# EAGLE design LaserGatesController (EAGLE 9.6.2)
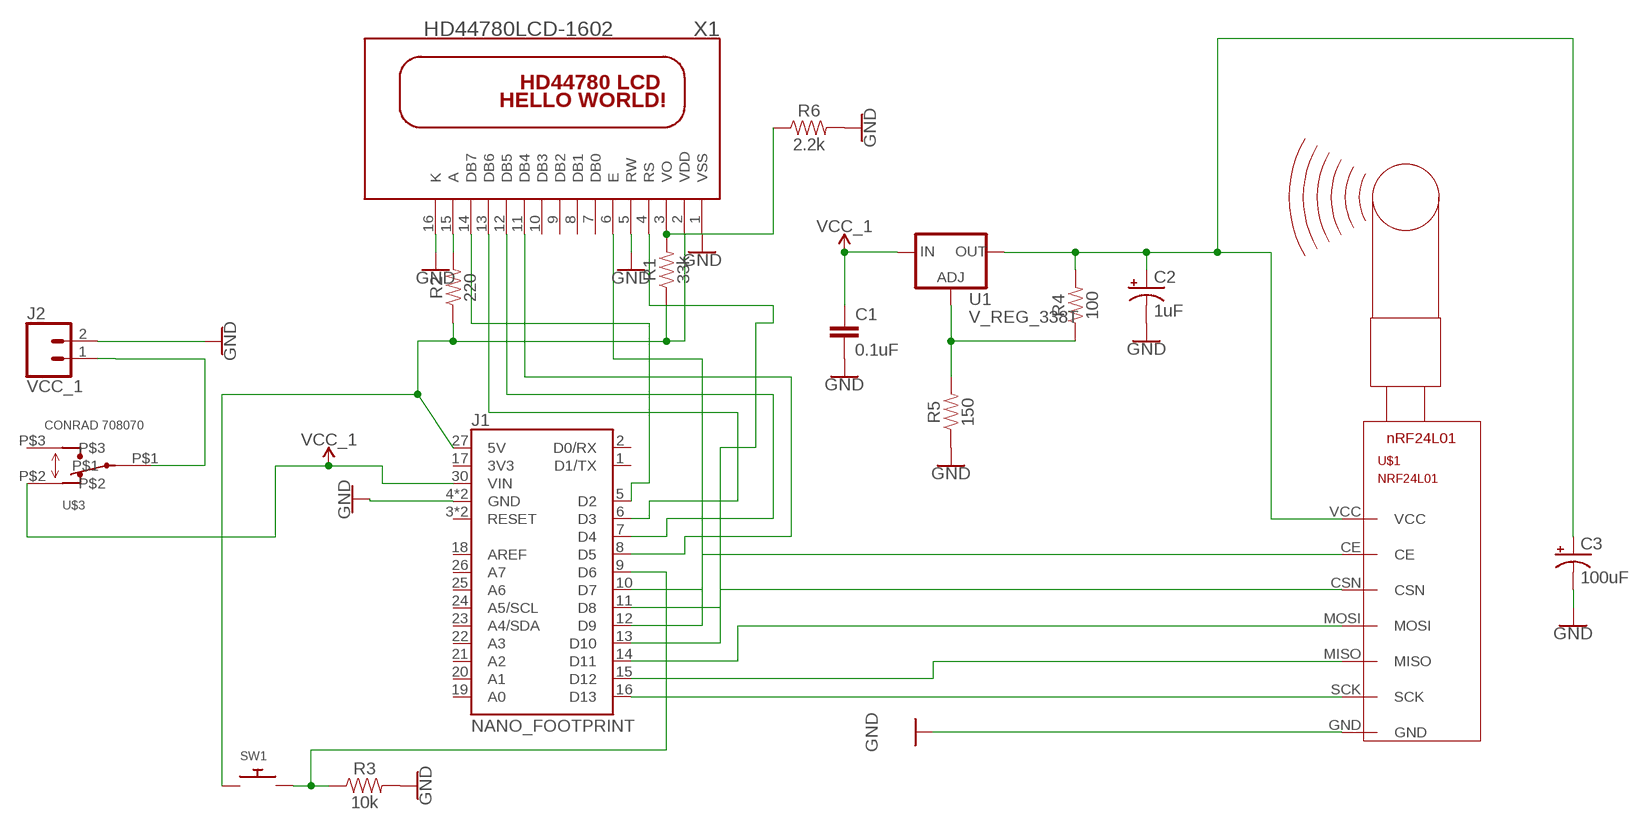
[diagram p0: schematic, sheet 1]

## Parts
C1  0.1uF  0.1UF-KIT-EZ-50V-20%  [CAP-PTH-SMALL-KIT]
C2  1uF  10UF-POLAR-RADIAL-2.5MM-25V-20%  [CPOL-RADIAL-2.5MM-5MM]
C3  100uF  1000UF-RADIAL-5MM-25V-20%  [CPOL-RADIAL-5MM-10MM]
J1  NANO_FOOTPRINT  [NANO]
J2  VCC_1  CONN_02  [1X02]
R1  33k  1KOHM-HORIZ-1/4W-1%  [AXIAL-0.3]
R2  220  1KOHM-HORIZ-1/4W-1%  [AXIAL-0.3]
R3  10k  10KOHM-HORIZ-1/4W-1%  [AXIAL-0.3]
R4  100  1KOHM-HORIZ-1/4W-1%  [AXIAL-0.3]
R5  150  1KOHM-HORIZ-1/4W-1%  [AXIAL-0.3]
R6  2.2k  1MOHM-HORIZ-1/6W-5%  [AXIAL-0.3]
SW1  SWITCH_PUSHBUTTONEVQ-PE  [TACT_PANA-EVQ]
U1  V_REG_338T  V_REG_317SINK  [TO220-ADJ]
U$1  NRF24L01  [NRF24L01]
U$3  SLIDE-SWITCH-CONRAD708070  [SLIDE-SWITCH-CONRAD708070]
X1  HD44780LCD-1602  [LCD1602]

## Nets
GND: C1.2 C2.2(-) C3.- J1.4(GND) J1.29(GND) J2.2 R3.P$2 R5.P$1 R6.P$2 U$1.GND X1.1(VSS) X1.5(RW) X1.16(K)
N$1: J1.11(D8) U$1.CSN
N$2: J1.10(D7) U$1.CE
N$3: J1.16(D13) U$1.SCK
N$4: J1.14(D11) U$1.MOSI
N$5: J1.15(D12) U$1.MISO
N$6: J1.5(D2) X1.14(DB7)
N$7: J1.13(D10) X1.4(RS)
N$8: J1.12(D9) X1.6(E)
N$9: J1.8(D5) X1.11(DB4)
N$10: J2.1 U$3.P$1
N$11: J1.7(D4) X1.12(DB5)
N$12: J1.6(D3) X1.13(DB6)
N$13: R4.P$1 R5.P$2 U1.ADJ
N$14: C2.1(+) C3.+ R4.P$2 U1.OUT U$1.VCC
N$15: R2.P$2 X1.15(A)
N$16: J1.9(D6) R3.P$1 SW1.P$2
N$17: R1.P$2 R6.P$1 X1.3(VO)
VCC_1: C1.1 J1.30(VIN) U1.IN U$3.P$2
VDD: J1.27(5V) R1.P$1 R2.P$1 SW1.P$1 X1.2(VDD)
Unconnected: J1.1(D1/TX) J1.2(D0/RX) J1.3(RESET) J1.17(3V3) J1.18(AREF) J1.19(A0) J1.20(A1) J1.21(A2) J1.22(A3) J1.23(A4/SDA) J1.24(A5/SCL) J1.25(A6) J1.26(A7) J1.28(RESET) U$3.P$3 X1.7(DB0) X1.8(DB1) X1.9(DB2) X1.10(DB3)

## Library data of the parts
C1 = SparkFun-Capacitors:0.1UF: 0.1µF ceramic capacitors A capacitor is a passive two-terminal electrical component used to store electrical energy temporarily in an electric field.; PROD_ID: CAP-08370
C2 = SparkFun-Capacitors:10UF-POLAR: 10.0µF polarized capacitors A capacitor is a passive two-terminal electrical component used to store electrical energy temporarily in an electric field.; PROD_ID: CAP-08440; VALUE: 10uF
C3 = SparkFun-Capacitors:1000UF: 1,000µF/1mF ceramic capacitors A capacitor is a passive two-terminal electrical component used to store electrical energy temporarily in an electric field. CAP-08070; PROD_ID: CAP-09538; VALUE: 1mF
J1 = SparkFun-Boards:NANO_FOOTPRINT: Generic Nano Footprint
J2 = SparkFun-Connectors:CONN_02: Multi connection point. Often used as Generic Header-pin footprint for 0.1 inch spaced/style header connections On any of the 0.1 inch spaced packages, you can populate with these: Break Away Headers - Straight <https://www.sparkfun.com/products/116> (PRT-00116) Break Away Male Headers - Right Angle <https://www.sparkfun.com/products/553> (PRT-00553) Female Headers <https://www.sparkfun.com/products/115> (PRT-00115) Break Away Headers - Machine Pin <https://www.sparkfun.com/products/117> (PRT-00117) Break Away Female Headers - Swiss Machine Pin <https://www.sparkfun.com/products/743> (PRT-00743) For SCREWTERMINALS and SPRING TERMINALS visit here: Screw Terimnals on SparkFun.com <https://www.sparkfun.com/search/results?term=Screw+Terminals> (5mm/3.5mm/2.54mm spacing) This device is also useful as a general connection point to wire up your design to another part of your project. Our various solder wires solder well into these plated through hole pads. Hook-Up Wire - Assortment (Stranded, 22 AWG) <https://www.sparkfun.com/products/11375> (PRT-11375) Hook-Up Wire - Assortment (Solid Core, 22 AWG) <https://www.sparkfun.com/products/11367> (PRT-11367) View the entire wire category on our website here <https://www.sparkfun.com/categories/141> Special notes: Molex polarized connector foot print use with: PRT-08233 with associated crimp pins and housings. 2.54_SCREWTERM for use with PRT-10571. 3.5mm Screw Terminal footprints for PRT-08084 5mm Screw Terminal footprints for use with PRT-08432
R1 R2 R4 R5 = SparkFun-Resistors:1KOHM: 1kΩ resistor A resistor is a passive two-terminal electrical component that implements electrical resistance as a circuit element. Resistors act to reduce current flow, and, at the same time, act to lower voltage levels within circuits. - Wikipedia; PROD_ID: RES-12182; VALUE: 1k
R3 = SparkFun-Resistors:10KOHM: 10kΩ resistor A resistor is a passive two-terminal electrical component that implements electrical resistance as a circuit element. Resistors act to reduce current flow, and, at the same time, act to lower voltage levels within circuits. - Wikipedia; PROD_ID: RES-12183
R6 = SparkFun-Resistors:1MOHM: 1MΩ resistor A resistor is a passive two-terminal electrical component that implements electrical resistance as a circuit element. Resistors act to reduce current flow, and, at the same time, act to lower voltage levels within circuits. - Wikipedia; PROD_ID: RES-09559; VALUE: 1M
SW1 = adafruit:SWITCH_PUSHBUTTON: Buttons SOFTTOUCHSMD_SJ - Soft touch temporary push button (Super Junk Akihabara) Compatible with SKPMANE010 [Mouser: 688-SKPMAN] C&K_KSS = Digikey: KSS221GLFS
U1 = SparkFun-IC-Power:V_REG_317: Voltage Regulator Standard LM317 adjustable voltage regulator. AOI (Adjust Output Input). Google 'LM317 Calculator' for easy to use app to get the two resistor values needed. 240/720 for 5V output. 240/390 for 3.3V output. Spark Fun Electronics SKU : COM-00527
U$1 = Clean-Kong:NRF24L01: nrF54L01 2.4GHz with 100 Channels Emitter/Reveiver SPI Controlled Roboshop / Minint
U$3 = Clean-Kong:SLIDE-SWITCH-CONRAD708070
X1 = adafruit:HD44780LCD: HD44780 LCD Standard character type LCDs, available in sizes from 8x1 to 40x4!

## Board
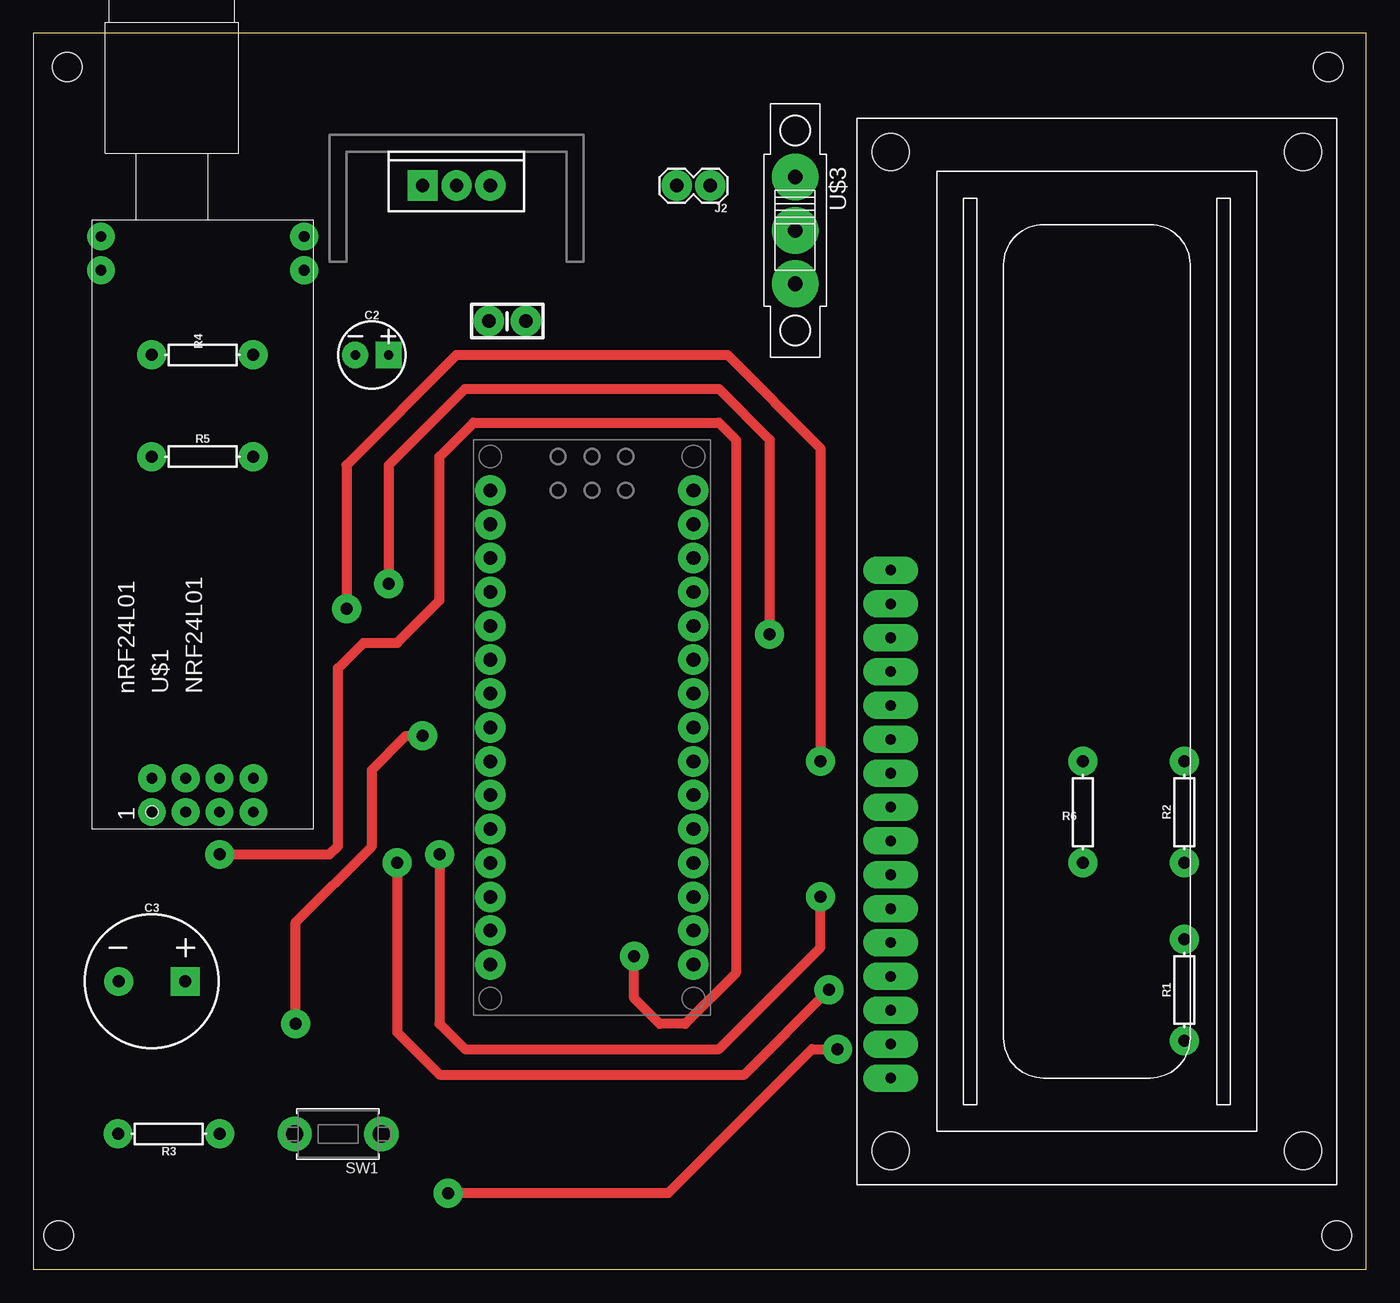
[diagram p1: board, top side]
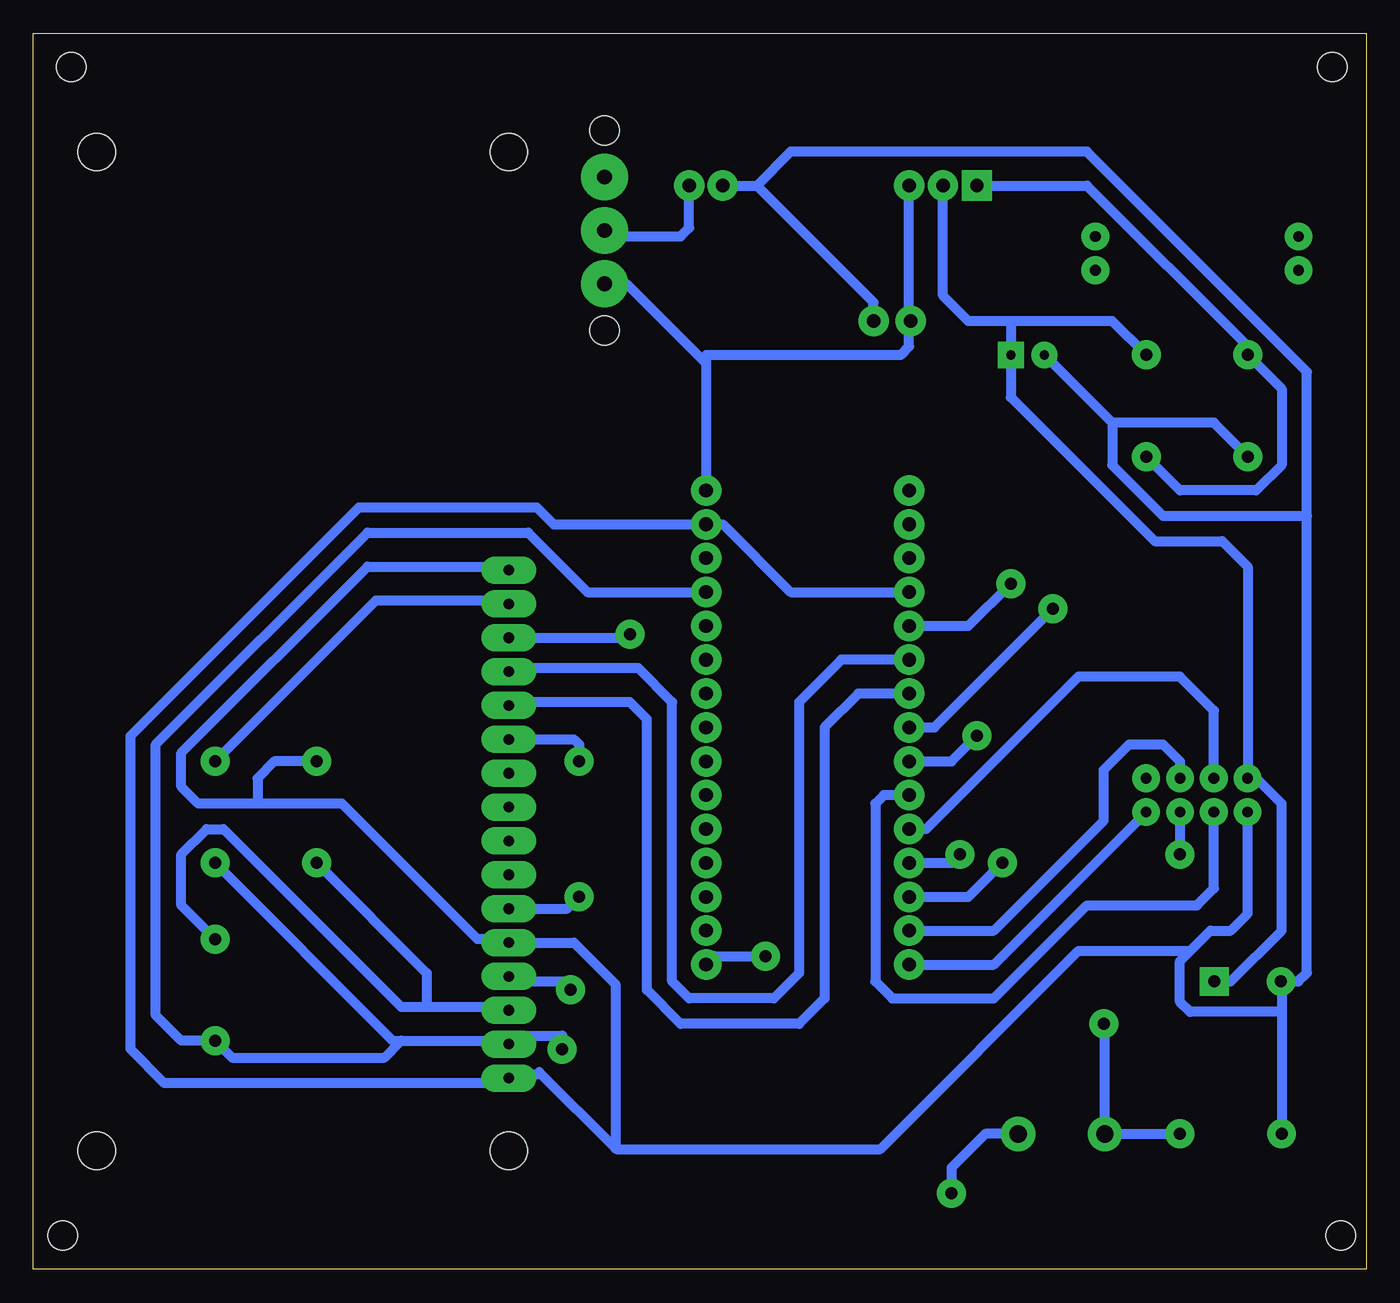
[diagram p2: board, bottom side, seen from below]

Size 100 x 92.7 mm. Coordinates in mm from the lower left corner, seen from the top.
Outline: 0,0 100,0 100,92.7 0,92.7 0,0
Copper layers (1*16): Top 0.035mm / dielectric 1.5mm / Bottom 0.035mm
Design rules "mydesignrules": minimum track width 30mil, minimum drill 0.9mm, track to track 30mil, track to pad 30mil, pad to pad 30mil, via to via 30mil, smd to smd 20mil, copper to edge 80mil, drill to drill 20mil, minimum pad ring 25mil, minimum via ring 25mil, stop-mask expansion 4mil, vias tented up to drill 0mil, thermal gap 10mil
Holes 2.2 mm at 97.16,90.17 97.79,2.54 1.91,2.54 2.54,90.17

### Footprints (pad centres in the part's own frame; a part is rotated, then mirrored left to right if it is on the bottom)
CAP-PTH-SMALL-KIT = drill 1.016 pad 2.032: 1 -1.397,0; 2 1.397,0
CPOL-RADIAL-2.5MM-5MM = drill 0.7 pad 1.651 square: 1 1.25,0 | drill 0.7 pad 1.651: 2 -1.25,0
CPOL-RADIAL-5MM-10MM = drill 0.9 pad 1.93 square: + 2.5,0 | drill 0.9 pad 1.93: - -2.5,0
NANO = drill 1.016: 1 -7.62,17.78; 2 -7.62,15.24; 3 -7.62,12.7; 4 -7.62,10.16; 5 -7.62,7.62; 6 -7.62,5.08; 7 -7.62,2.54; 8 -7.62,0; 9 -7.62,-2.54; 10 -7.62,-5.08; 11 -7.62,-7.62; 12 -7.62,-10.16; 13 -7.62,-12.7; 14 -7.62,-15.24; 15 -7.62,-17.78; 16 7.62,-17.78; 17 7.62,-15.24; 18 7.62,-12.7; 19 7.62,-10.16; 20 7.62,-7.62; 21 7.62,-5.08; 22 7.62,-2.54; 23 7.62,0; 24 7.62,2.54; 25 7.62,5.08; 26 7.62,7.62; 27 7.62,10.16; 28 7.62,12.7; 29 7.62,15.24; 30 7.62,17.78
1X02 = drill 1.016 pad 1.88: 1 0,0; 2 2.54,0
AXIAL-0.3 = drill 0.9 pad 1.88: P$1 -3.81,0; P$2 3.81,0
TACT_PANA-EVQ = drill 1.3 pad 2.54: P$1 -3.25,0; P$2 3.25,0
TO220-ADJ = drill 1 pad 1.88 square: ADJ -2.54,0 | drill 1 pad 1.88: IN 2.54,0; OUT 0,0
NRF24L01 = drill 0.8 pad 1.676: CE 0,-2.54; CSN 2.54,-2.54; GND 0,0; MISO 0,-7.62; MOSI 2.54,-5.08; P$1 40.64,-11.43; P$2 43.18,-11.43; P$3 43.18,3.81; P$4 40.64,3.81; P$8 2.54,-7.62; SCK 0,-5.08; VCC 2.54,0
SLIDE-SWITCH-CONRAD708070 = drill 1.1 pad 3.5: P$1 4,0; P$2 8,0; P$3 0,0 | hole 2.2: -3.5,0; 11.5,0
LCD1602 = drill 0.8 long: 1 8,33.46; 2 10.54,33.46; 3 13.08,33.46; 4 15.62,33.46; 5 18.16,33.46; 6 20.7,33.46; 7 23.24,33.46; 8 25.78,33.46; 9 28.32,33.46; 10 30.86,33.46; 11 33.4,33.46; 12 35.94,33.46; 13 38.48,33.46; 14 41.02,33.46; 15 43.56,33.46; 16 46.1,33.46 | hole 2.8: 2.54,2.54; 2.54,33.46; 77.46,33.46; 77.46,2.54

### Placement (x,y rotation side)
C1  35.56,71.12 0 top
C2  25.4,68.58 0 top
C3  8.89,21.59 0 top
J1  41.91,40.64 0 top
J2  50.8,81.28 180 top
R1  86.36,20.95 90 top
R2  86.36,34.29 90 top
R3  10.16,10.16 180 top
R4  12.7,68.58 0 top
R5  12.7,60.96 0 top
R6  78.74,34.29 90 top
SW1  22.86,10.16 180 top
U1  31.75,81.28 0 top
U$1  8.89,34.29 90 top
U$3  57.15,81.92 270 top
X1  97.79,6.35 90 top

### Tracks (layer width: path | path; a pad name or v marks a point on that pad's centre or on a via)
GND
  Bottom 0.762: 45.72,81.28 36.96,72.52 C1.2 | J2.2 45.72,81.28 | 19.05,63.5 24.13,68.58 C2.2 | 19.05,63.5 11.43,63.5 R5.P$1 | 45.72,81.28 43.18,83.82 20.95,83.82 4.45,67.31 4.45,56.52 | 4.45,56.52 15.24,56.52 19.05,60.33 19.05,63.5 | J1.4 43.18,50.8 48.26,55.88 J1.29 60.96,55.88 62.23,57.15 75.56,57.15 92.71,40.01 92.71,16.51 90.17,13.97 64.77,13.97 X1.1 64.14,14.61 62.23,14.61 62.04,14.8 56.33,9.08 | U$1.GND 8.89,26.67 10.16,25.4 11.68,25.4 13.21,23.88 | 6.99,21.59 C3.- 6.35,21.59 | 83.19,34.92 76.83,34.92 66.67,24.77 64.77,24.77 X1.5 59.44,24.51 56.33,21.4 56.33,9.08 | 83.19,34.92 87.63,34.92 88.9,36.2 88.9,38.73 74.93,52.7 64.77,52.7 X1.16 | 6.35,21.59 5.08,21.59 4.45,22.23 4.45,56.52 | 6.35,21.59 6.35,19.3 | 6.35,19.3 R3.P$2 | 13.21,23.88 13.97,23.11 13.97,20.07 13.21,19.3 6.35,19.3 | 13.21,23.88 21.59,23.88 36.45,9.02 56.26,9.02 56.33,9.08 | R6.P$2 81.92,38.1 83.19,36.83 83.19,34.92
N$1
  Bottom 0.762: U$1.CSN 11.43,41.91 13.97,44.45 21.59,44.45 33.02,33.02 J1.11
N$2
  Bottom 0.762: U$1.CE 11.43,28.57 12.7,27.3 20.95,27.3 27.94,20.32 35.56,20.32 36.83,21.59 36.83,34.92 36.2,35.56 J1.10
N$3  (via drill 0.9)
  Top 0.762: v13.97,31.11 22.23,31.11 22.86,31.75 22.86,45.09 24.77,46.99 27.3,46.99 30.48,50.16 30.48,60.96 33.02,63.5 51.44,63.5 52.7,62.23 52.7,22.23 48.9,18.41 46.99,18.41 45.09,20.32 v45.09,23.5
  Bottom 0.762: U$1.SCK v13.97,31.11 | J1.16 48.9,23.5 v45.09,23.5
N$4
  Bottom 0.762: U$1.MOSI 13.97,38.1 15.24,39.37 17.78,39.37 19.68,37.47 19.68,33.66 27.94,25.4 J1.14
N$5
  Bottom 0.762: U$1.MISO 27.94,22.86 J1.15
N$6  (via drill 0.9)
  Top 0.762: v26.67,51.44 26.67,60.33 32.38,66.04 51.44,66.04 55.24,62.23 v55.24,47.62
  Bottom 0.762: X1.14 55.5,47.37 v55.24,47.62 | J1.5 29.84,48.26 v26.67,51.44
N$7  (via drill 0.9)
  Top 0.762: v27.3,30.48 27.3,17.78 30.48,14.61 53.34,14.61 v59.69,20.95
  Bottom 0.762: X1.4 63.97,21.61 62.39,21.61 62.38,21.59 60.33,21.59 v59.69,20.95 | J1.13 29.84,27.94 v27.3,30.48
N$8  (via drill 0.9)
  Top 0.762: v30.48,31.11 30.48,18.41 32.38,16.51 51.44,16.51 59.05,24.13 v59.05,27.94
  Bottom 0.762: X1.6 59.95,27.05 v59.05,27.94 | J1.12 31.11,30.48 v30.48,31.11
N$9  (via drill 0.9)
  Top 0.762: v23.5,49.53 23.5,60.33 31.75,68.58 52.07,68.58 59.05,61.59 v59.05,38.1
  Bottom 0.762: J1.8 32.38,40.64 v23.5,49.53 | X1.11 59.44,39.75 59.05,39.37 v59.05,38.1
N$10
  Bottom 0.762: U$3.P$1 56.7,77.47 51.44,77.47 50.8,78.11 J2.1
N$11
  Bottom 0.762: X1.12 64.08,42.55 55.24,42.55 53.98,41.27 53.98,20.95 51.44,18.41 42.55,18.41 40.64,20.32 40.64,40.64 38.1,43.18 J1.7
N$12
  Bottom 0.762: J1.6 39.37,45.72 42.55,42.55 42.55,22.23 44.45,20.32 50.8,20.32 52.07,21.59 52.07,42.55 54.61,45.09 64.14,45.09 X1.13
N$13
  Bottom 0.762: U1.ADJ 20.95,81.28 8.89,69.22 R4.P$1 6.35,66.04 6.35,60.33 8.26,58.42 13.97,58.42 R5.P$2
N$14
  Bottom 0.762: C3.+ 10.16,21.59 6.35,25.4 6.35,34.92 8.26,36.83 U$1.VCC 8.89,52.7 10.79,54.61 15.88,54.61 26.67,65.41 26.67,68.58 | 26.67,71.12 26.67,68.58 | 26.67,71.12 19.05,71.12 R4.P$2 | 26.67,71.12 29.84,71.12 31.75,73.03 U1.OUT | 26.67,68.58 C2.1
N$15
  Bottom 0.762: R2.P$2 74.3,50.16 64.77,50.16 X1.15
N$16  (via drill 0.9)
  Top 0.762: v19.68,18.41 19.68,26.04 25.4,31.75 25.4,37.47 27.94,40.01 v29.21,40.01
  Bottom 0.762: 19.05,9.91 SW1.P$2 | SW1.P$2 R3.P$1 | SW1.P$2 19.61,18.34 v19.68,18.41 | J1.9 31.11,38.1 v29.21,40.01
N$17
  Bottom 0.762: 70.48,19.68 72.39,19.68 85.72,33.02 87,33.02 88.9,31.11 88.9,27.3 R1.P$2 | 70.48,19.68 64.77,19.68 X1.3 | 70.48,19.68 70.48,22.23 R6.P$1
VCC_1
  Bottom 0.762: 34.29,71.12 U1.IN | 49.53,67.94 49.53,68.58 34.92,68.58 34.29,69.22 34.29,71.12 | 49.53,67.94 J1.30 | U$3.P$2 55.5,73.92 49.53,67.94 | 34.29,71.12 C1.1
VDD  (via drill 0.9)
  Top 0.762: v31.11,5.71 47.62,5.71 58.42,16.51 v60.33,16.51
  Bottom 0.762: 72.39,17.14 73.03,17.14 R2.P$1 | 72.39,17.14 64.77,17.14 X1.2 63.7,17.52 60.33,17.52 v60.33,16.51 | J1.27 58.42,50.8 62.87,55.24 74.93,55.24 90.81,39.37 90.81,19.05 88.9,17.14 R1.P$1 85.09,15.88 73.66,15.88 72.39,17.14 | SW1.P$1 28.57,10.16 31.11,7.62 v31.11,5.71